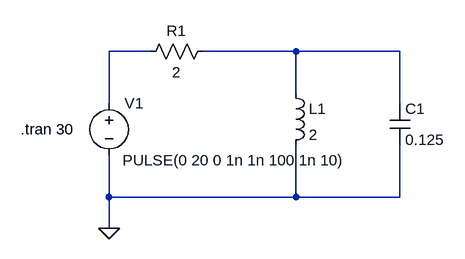
[diagram p0: schematic EXPT_1_PART_2B.asc]
EXPT_1_PART_2B.asc, the LTspice schematic file:
Version 4
SHEET 1 880 680
WIRE 16 32 -48 32
WIRE 240 32 96 32
WIRE 400 32 240 32
WIRE 240 96 240 32
WIRE -48 112 -48 32
WIRE 400 112 400 32
WIRE -48 256 -48 192
WIRE 240 256 240 176
WIRE 240 256 -48 256
WIRE 400 256 400 176
WIRE 400 256 240 256
WIRE -48 304 -48 256
FLAG -48 304 0
SYMBOL res 112 16 R90
WINDOW 0 0 56 VBottom 2
WINDOW 3 32 56 VTop 2
SYMATTR InstName R1
SYMATTR Value 2
SYMBOL cap 384 112 R0
SYMATTR InstName C1
SYMATTR Value 0.125
SYMBOL ind 224 80 R0
SYMATTR InstName L1
SYMATTR Value 2
SYMBOL voltage -48 96 R0
WINDOW 3 21 103 Left 2
WINDOW 123 24 124 Left 2
WINDOW 39 0 0 Left 0
SYMATTR Value PULSE(0 20 0 1n 1n 100 1n 10)
SYMATTR InstName V1
TEXT -184 152 Left 2 !.tran 30

The netlist it stands for:
* EXPT_1_PART_2B.asc
R1 N002 N001 2
C1 N002 0 0.125
L1 N002 0 2
V1 N001 0 PULSE(0 20 0 1n 1n 100 1n 10)
.tran 30
.backanno
.end